# EAGLE design STMv1 (EAGLE 7.3.0)
CNAME: EARS PocketQube Template; CREVISION: 0.1; DESIGNER: M. Isbell & L. Stant
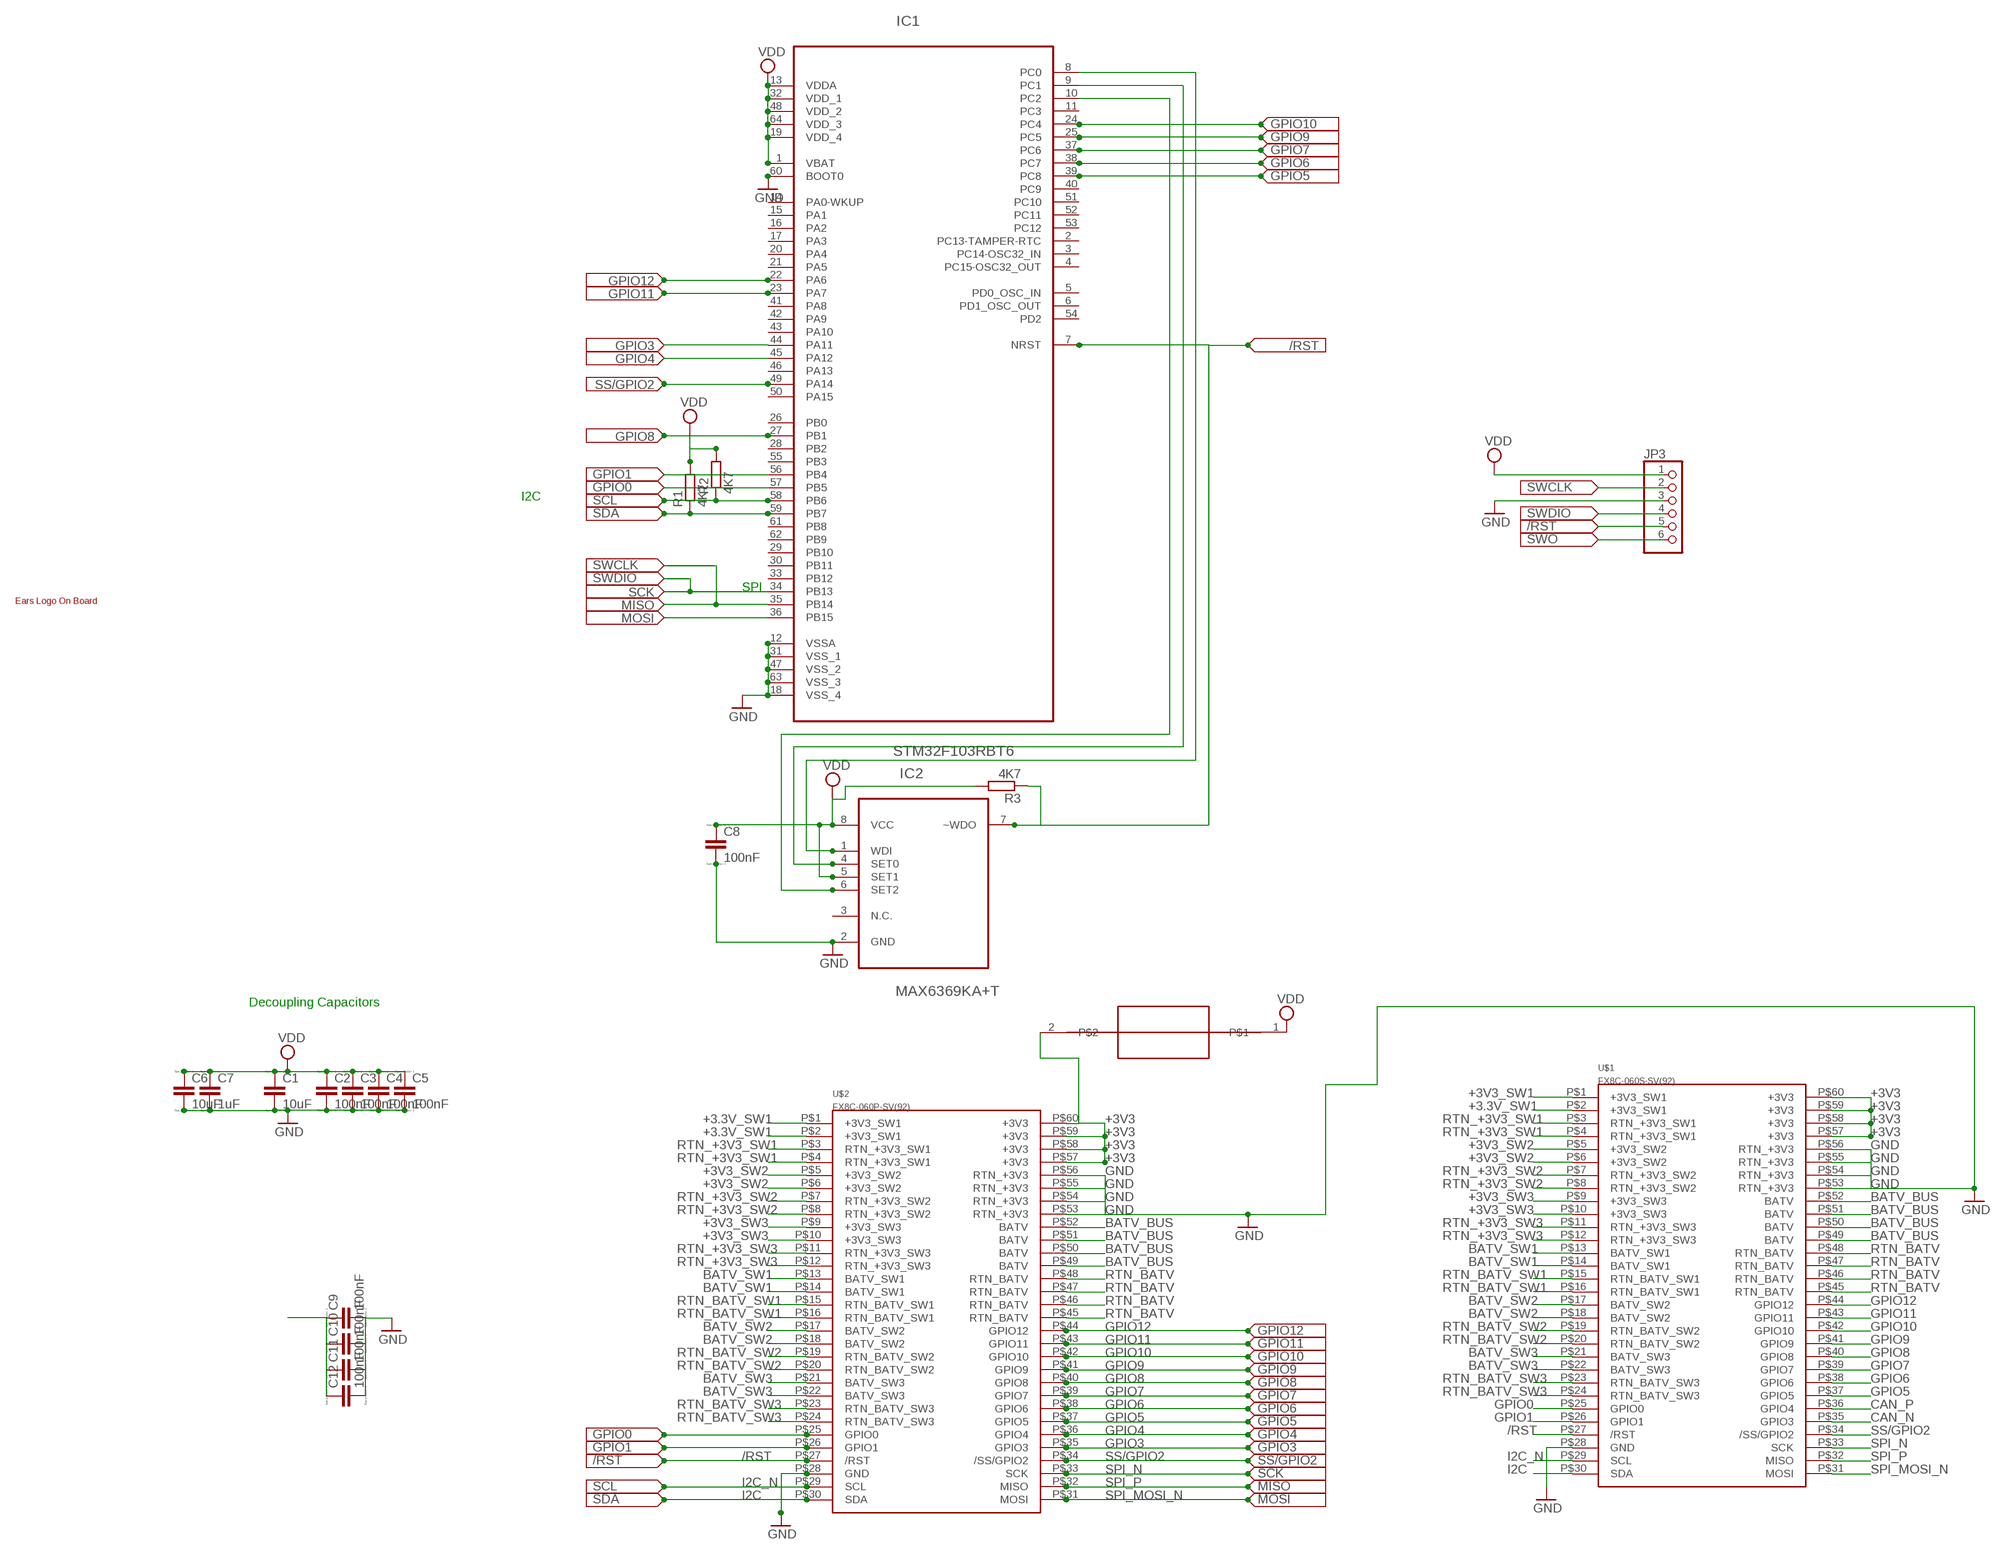
[diagram p0: schematic, sheet 1]

## Parts
C1  10uF  CC0603  [C0603]
C2  100nF  CC0603  [C0603]
C3  100nF  CC0603  [C0603]
C4  100nF  CC0603  [C0603]
C5  100nF  CC0603  [C0603]
C6  10uF  CC0603  [C0603]
C7  1uF  CC0603  [C0603]
C8  100nF  CC0603  [C0603]
C9  100nF  CC0603  [C0603]
C10  100nF  CC0603  [C0603]
C11  100nF  CC0603  [C0603]
C12  100nF  CC0603  [C0603]
FUSE  0603POLYFUSE  [R0603]
IC1  STM32F103RBT6  [QFP50P1200X1200X160-64N]
IC2  MAX6369KA+T  [SOT65P280X145-8N]
JP3  PINHD-1X6  [1X06]
R1  4K7  R-EU_R0603  [R0603]
R2  4K7  R-EU_R0603  [R0603]
R3  4K7  R-EU_R0603  [R0603]
U$1  FX8C-060S-SV(92)  [FX8C-060S-SV(92)]
U$2  FX8C-060P-SV(92)  [FX8C-060P-SV(92)]
U$3  EARSLOGOFULL  [EARSLOGOFULL]

## Nets
+3.3V_SW1: U$1.P$2(+3V3_SW1) U$2.P$1(+3V3_SW1) U$2.P$2(+3V3_SW1)
+3V3: FUSE.2 U$1.P$57(+3V3) U$1.P$58(+3V3) U$1.P$59(+3V3) U$1.P$60(+3V3) U$2.P$57(+3V3) U$2.P$58(+3V3) U$2.P$59(+3V3) U$2.P$60(+3V3)
+3V3_SW1: U$1.P$1(+3V3_SW1)
+3V3_SW2: U$1.P$5(+3V3_SW2) U$1.P$6(+3V3_SW2) U$2.P$5(+3V3_SW2) U$2.P$6(+3V3_SW2)
+3V3_SW3: U$1.P$9(+3V3_SW3) U$1.P$10(+3V3_SW3) U$2.P$9(+3V3_SW3) U$2.P$10(+3V3_SW3)
/RST: IC1.7(NRST) IC2.7(~WDO) R3.1 U$1.P$27(/RST) U$2.P$27(/RST)
BATV_BUS: U$1.P$49(BATV) U$1.P$50(BATV) U$1.P$51(BATV) U$1.P$52(BATV) U$2.P$49(BATV) U$2.P$50(BATV) U$2.P$51(BATV) U$2.P$52(BATV)
BATV_SW1: U$1.P$13(BATV_SW1) U$1.P$14(BATV_SW1) U$2.P$13(BATV_SW1) U$2.P$14(BATV_SW1)
BATV_SW2: U$1.P$17(BATV_SW2) U$1.P$18(BATV_SW2) U$2.P$17(BATV_SW2) U$2.P$18(BATV_SW2)
BATV_SW3: U$1.P$21(BATV_SW3) U$1.P$22(BATV_SW3) U$2.P$21(BATV_SW3) U$2.P$22(BATV_SW3)
CAN_N: U$1.P$35(GPIO3)
CAN_P: U$1.P$36(GPIO4)
CHASSIS_GND: C9.1 C10.1 C11.1 C12.1
GND: C1.2 C2.2 C3.2 C4.2 C5.2 C6.2 C7.2 C8.2 C9.2 C10.2 C11.2 C12.2 IC1.12(VSSA) IC1.18(VSS_4) IC1.31(VSS_1) IC1.47(VSS_2) IC1.60(BOOT0) IC1.63(VSS_3) IC2.2(GND) JP3.3(GND) U$1.P$28(GND) U$1.P$53(RTN_+3V3) U$1.P$54(RTN_+3V3) U$1.P$55(RTN_+3V3) U$1.P$56(RTN_+3V3) U$2.P$28(GND) U$2.P$53(RTN_+3V3) U$2.P$54(RTN_+3V3) U$2.P$55(RTN_+3V3) U$2.P$56(RTN_+3V3)
GPIO0: IC1.57(PB5) U$1.P$25(GPIO0) U$2.P$25(GPIO0)
GPIO1: IC1.56(PB4) U$1.P$26(GPIO1) U$2.P$26(GPIO1)
GPIO3: IC1.44(PA11) U$2.P$35(GPIO3)
GPIO4: IC1.45(PA12) U$2.P$36(GPIO4)
GPIO5: IC1.39(PC8) U$1.P$37(GPIO5) U$2.P$37(GPIO5)
GPIO6: IC1.38(PC7) U$1.P$38(GPIO6) U$2.P$38(GPIO6)
GPIO7: IC1.37(PC6) U$1.P$39(GPIO7) U$2.P$39(GPIO7)
GPIO8: IC1.27(PB1) U$1.P$40(GPIO8) U$2.P$40(GPIO8)
GPIO9: IC1.25(PC5) U$1.P$41(GPIO9) U$2.P$41(GPIO9)
GPIO10: IC1.24(PC4) U$1.P$42(GPIO10) U$2.P$42(GPIO10)
GPIO11: IC1.23(PA7) U$1.P$43(GPIO11) U$2.P$43(GPIO11)
GPIO12: IC1.22(PA6) U$1.P$44(GPIO12) U$2.P$44(GPIO12)
I2C: IC1.59(PB7) R1.1 U$1.P$30(SDA) U$2.P$30(SDA)
I2C_N: IC1.58(PB6) R2.1 U$1.P$29(SCL) U$2.P$29(SCL)
N$25: JP3.5(NRST)
N$26: JP3.6(SWO)
RTN_+3V3_SW1: U$1.P$3(RTN_+3V3_SW1) U$1.P$4(RTN_+3V3_SW1) U$2.P$3(RTN_+3V3_SW1) U$2.P$4(RTN_+3V3_SW1)
RTN_+3V3_SW2: U$1.P$7(RTN_+3V3_SW2) U$1.P$8(RTN_+3V3_SW2) U$2.P$7(RTN_+3V3_SW2) U$2.P$8(RTN_+3V3_SW2)
RTN_+3V3_SW3: U$1.P$11(RTN_+3V3_SW3) U$1.P$12(RTN_+3V3_SW3) U$2.P$11(RTN_+3V3_SW3) U$2.P$12(RTN_+3V3_SW3)
RTN_BATV: U$1.P$45(RTN_BATV) U$1.P$46(RTN_BATV) U$1.P$47(RTN_BATV) U$1.P$48(RTN_BATV) U$2.P$45(RTN_BATV) U$2.P$46(RTN_BATV) U$2.P$47(RTN_BATV) U$2.P$48(RTN_BATV)
RTN_BATV_SW1: U$1.P$15(RTN_BATV_SW1) U$1.P$16(RTN_BATV_SW1) U$2.P$15(RTN_BATV_SW1) U$2.P$16(RTN_BATV_SW1)
RTN_BATV_SW2: U$1.P$19(RTN_BATV_SW2) U$1.P$20(RTN_BATV_SW2) U$2.P$19(RTN_BATV_SW2) U$2.P$20(RTN_BATV_SW2)
RTN_BATV_SW3: U$1.P$23(RTN_BATV_SW3) U$1.P$24(RTN_BATV_SW3) U$2.P$23(RTN_BATV_SW3) U$2.P$24(RTN_BATV_SW3)
SET0: IC1.9(PC1) IC2.4(SET0)
SET2: IC1.10(PC2) IC2.6(SET2)
SPI_MOSI_N: IC1.36(PB15) U$1.P$31(MOSI) U$2.P$31(MOSI)
SPI_N: IC1.34(PB13) JP3.4(SWDIO) U$1.P$33(SCK) U$2.P$33(SCK)
SPI_P: IC1.35(PB14) JP3.2(SWCLK) U$1.P$32(MISO) U$2.P$32(MISO)
SS/GPIO2: IC1.49(PA14) U$1.P$34(/SS/GPIO2) U$2.P$34(/SS/GPIO2)
VDD: C1.1 C2.1 C3.1 C4.1 C5.1 C6.1 C7.1 C8.1 FUSE.1 IC1.1(VBAT) IC1.13(VDDA) IC1.19(VDD_4) IC1.32(VDD_1) IC1.48(VDD_2) IC1.64(VDD_3) IC2.5(SET1) IC2.8(VCC) JP3.1(VDD) R1.2 R2.2 R3.2
WDI: IC1.8(PC0) IC2.1(WDI)
Unconnected: IC1.2(PC13-TAMPER-RTC) IC1.3(PC14-OSC32_IN) IC1.4(PC15-OSC32_OUT) IC1.5(PD0_OSC_IN) IC1.6(PD1_OSC_OUT) IC1.11(PC3) IC1.14(PA0-WKUP) IC1.15(PA1) IC1.16(PA2) IC1.17(PA3) IC1.20(PA4) IC1.21(PA5) IC1.26(PB0) IC1.28(PB2) IC1.29(PB10) IC1.30(PB11) IC1.33(PB12) IC1.40(PC9) IC1.41(PA8) IC1.42(PA9) IC1.43(PA10) IC1.46(PA13) IC1.50(PA15) IC1.51(PC10) IC1.52(PC11) IC1.53(PC12) IC1.54(PD2) IC1.55(PB3) IC1.61(PB8) IC1.62(PB9) IC2.3(N.C.)

## Notes on the sheet
- I2C
- SPI
- Decoupling Capacitors

## Library data of the parts
C1-C12 = eagle-ltspice:C: CAPACITOR, European symbol; SPICEMODEL: NONE; SPICEPREFIX: C
FUSE = ears:0603POLYFUSE: 0.5A tripping polyfuse in a 0603 package http://uk.mouser.com/ProductDetail/Littelfuse/0603L050YR/?qs=sGAEpiMZZMsxR%252bBXi4wRUGXbnHLoKJyJNdWU1GmyYlY%3d
IC1 = st-Microelctronicl2:STM32F103RBT6: 32BIT MCU; MPN: STM32F103RBT6; OC_FARNELL: 1447640; OC_NEWARK: 59M2183; PACKAGE: LQFP-64; SUPPLIER: STMICROELECTRONICS
IC2 = maxim2:MAX6369KA+T: Pin-Selectable Watchdog Timers; MPN: MAX6369KA+T; OC_FARNELL: 1787051; OC_NEWARK: 68K9450; PACKAGE: SOT23-8; SUPPLIER: Maxim
JP3 = pinhead:PINHD-1X6: PIN HEADER
R1-R3 = rcl:R-EU_: RESISTOR, European symbol
U$1 = Template:FX8C-060S-SV(92)
U$2 = Template:FX8C-060P-SV(92)
U$3 = ears:EARSLOGO: The SurreyEARS logo for use on PCB silkscreens. Try to use the full logo where possible please.

## Board
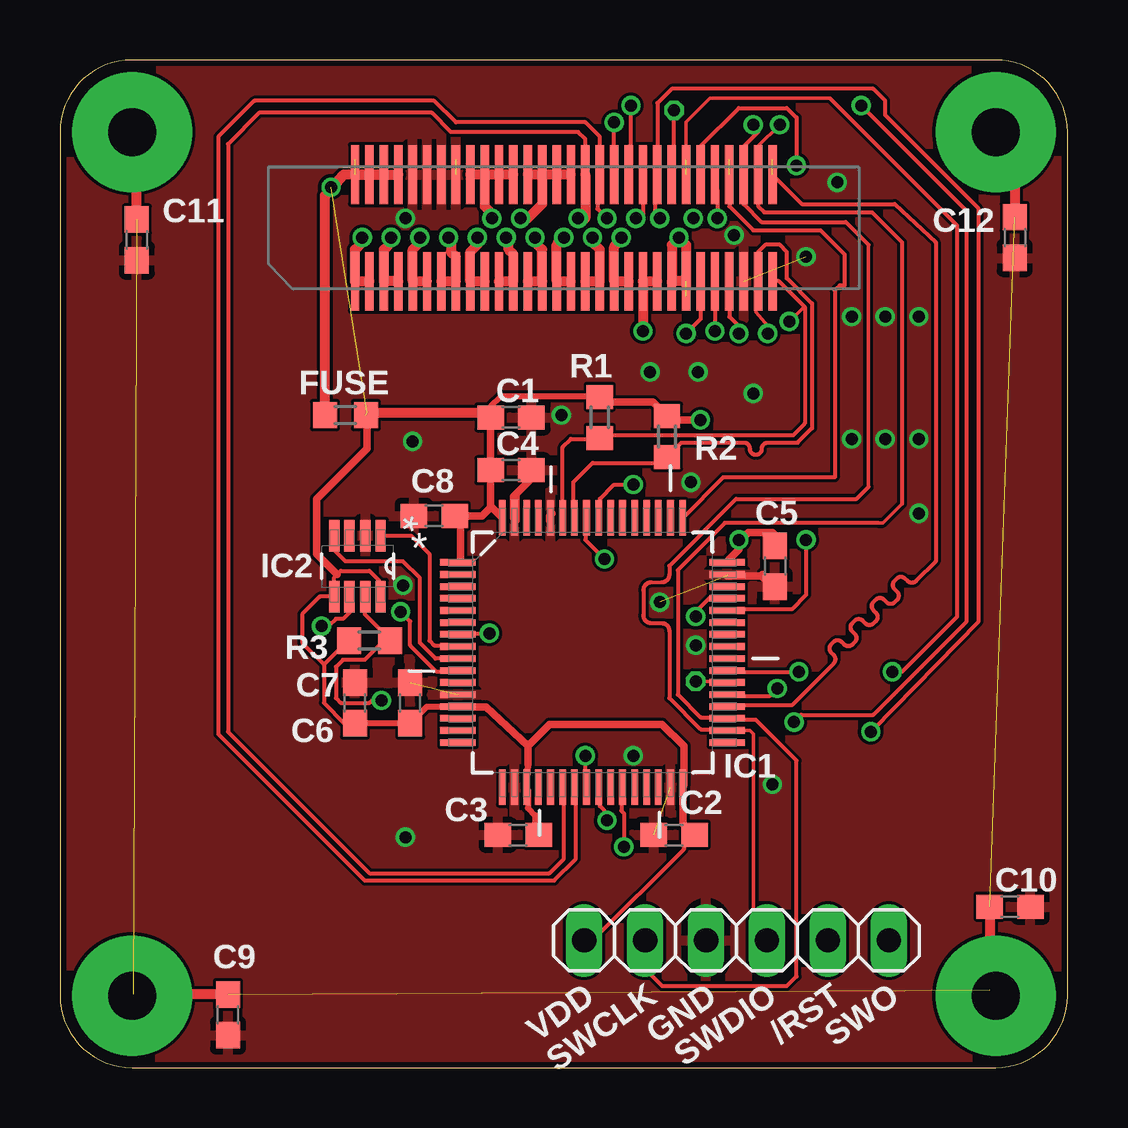
[diagram p1: board, top side]
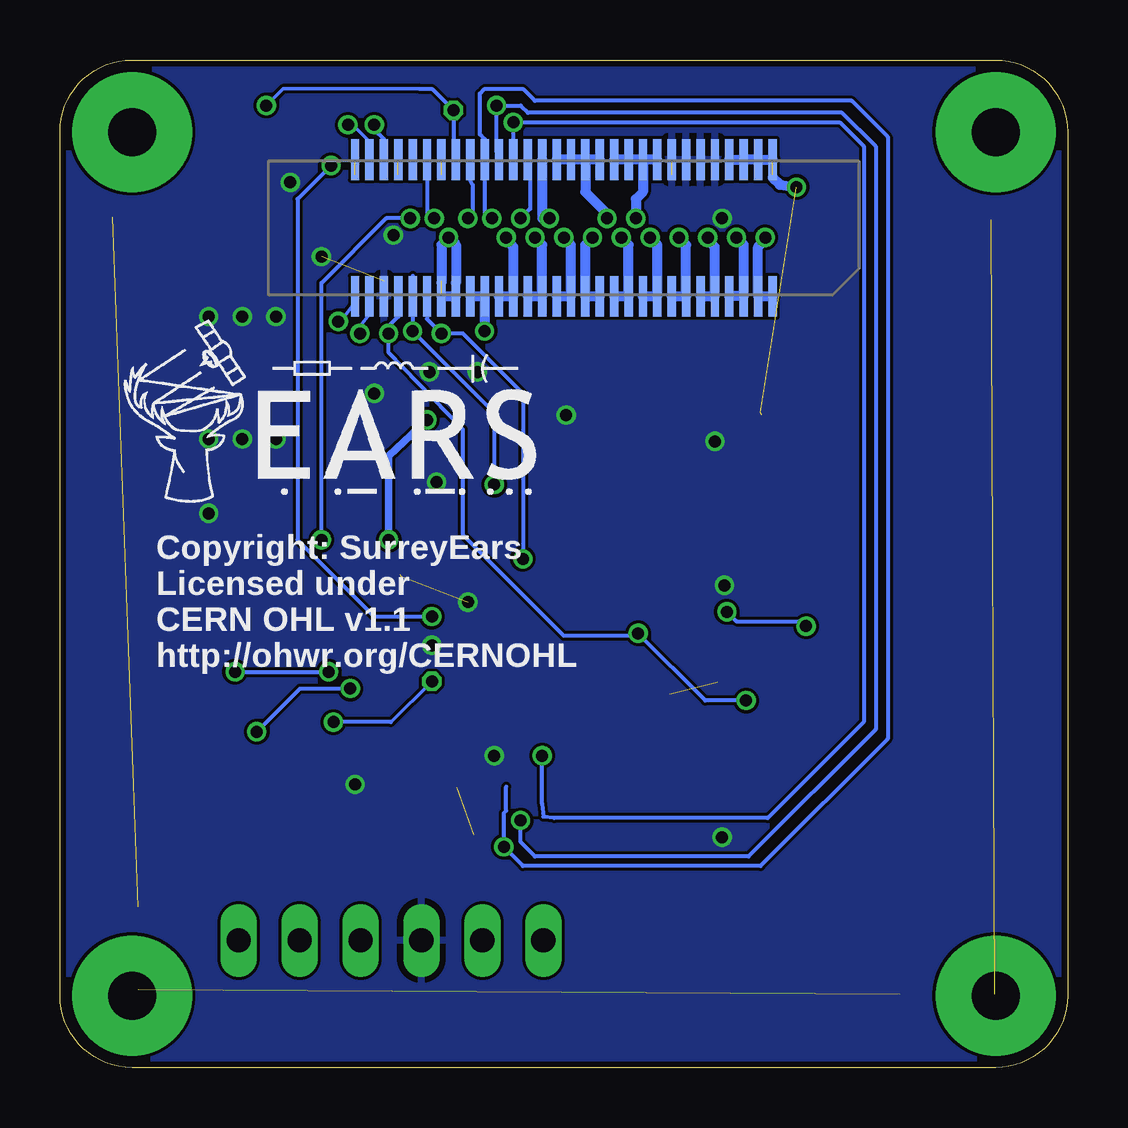
[diagram p2: board, bottom side, seen from below]

Size 42 x 42 mm. Coordinates in mm from the lower left corner, seen from the top.
Outline: 3,0 39,0 arc90 42,3 42,39 arc90 39,42 3,42 arc90 0,39 0,3 arc90 3,0
Copper layers (1*16): Top 0.035mm / dielectric 1.5mm / Bottom 0.035mm
Design rules "dirt_cheap_dirty_boards.v1": minimum track width 5mil, minimum drill 12mil, track to track 5mil, track to pad 5mil, pad to pad 5mil, via to via 5mil, smd to smd 0mil, copper to edge 10mil, drill to drill 10mil, minimum pad ring 10mil, minimum via ring 6mil, stop-mask expansion 2mil, vias tented up to drill 25mil, thermal gap 10mil

### Footprints (pad centres in the part's own frame; a part is rotated, then mirrored left to right if it is on the bottom)
C0603 = smd 1.1 x 1: 1 -0.85,0; 2 0.85,0
R0603 = smd 1 x 1.1: 1 -0.85,0; 2 0.85,0
QFP50P1200X1200X160-64N = smd 1.473 x 0.279: 1 -5.613,3.759; 2 -5.613,3.251; 3 -5.613,2.743; 4 -5.613,2.261; 5 -5.613,1.753; 6 -5.613,1.245; 7 -5.613,0.762; 8 -5.613,0.254; 9 -5.613,-0.254; 10 -5.613,-0.762; 11 -5.613,-1.245; 12 -5.613,-1.753; 13 -5.613,-2.261; 14 -5.613,-2.743; 15 -5.613,-3.251; 16 -5.613,-3.759; 33 5.613,-3.759; 34 5.613,-3.251; 35 5.613,-2.743; 36 5.613,-2.261; 37 5.613,-1.753; 38 5.613,-1.245; 39 5.613,-0.762; 40 5.613,-0.254; 41 5.613,0.254; 42 5.613,0.762; 43 5.613,1.245; 44 5.613,1.753; 45 5.613,2.261; 46 5.613,2.743; 47 5.613,3.251; 48 5.613,3.759 | smd 0.279 x 1.473: 17 -3.759,-5.613; 18 -3.251,-5.613; 19 -2.743,-5.613; 20 -2.261,-5.613; 21 -1.753,-5.613; 22 -1.245,-5.613; 23 -0.762,-5.613; 24 -0.254,-5.613; 25 0.254,-5.613; 26 0.762,-5.613; 27 1.245,-5.613; 28 1.753,-5.613; 29 2.261,-5.613; 30 2.743,-5.613; 31 3.251,-5.613; 32 3.759,-5.613; 49 3.759,5.613; 50 3.251,5.613; 51 2.743,5.613; 52 2.261,5.613; 53 1.753,5.613; 54 1.245,5.613; 55 0.762,5.613; 56 0.254,5.613; 57 -0.254,5.613; 58 -0.762,5.613; 59 -1.245,5.613; 60 -1.753,5.613; 61 -2.261,5.613; 62 -2.743,5.613; 63 -3.251,5.613; 64 -3.759,5.613
SOT65P280X145-8N = smd 1.321 x 0.432: 1 -1.27,0.965; 2 -1.27,0.33; 3 -1.27,-0.33; 4 -1.27,-0.965; 5 1.27,-0.965; 6 1.27,-0.33; 7 1.27,0.33; 8 1.27,0.965
1X06 = drill 1.016 long: 1 -6.35,0; 2 -3.81,0; 3 -1.27,0; 4 1.27,0; 5 3.81,0; 6 6.35,0
FX8C-060S-SV(92) = smd 0.35 x 1.7: P$1 -8.7,2.85; P$2 -8.1,2.85; P$3 -7.5,2.85; P$4 -6.9,2.85; P$5 -6.3,2.85; P$6 -5.7,2.85; P$7 -5.1,2.85; P$8 -4.5,2.85; P$9 -3.9,2.85; P$10 -3.3,2.85; P$11 -2.7,2.85; P$12 -2.1,2.85; P$13 -1.5,2.85; P$14 -0.9,2.85; P$15 -0.3,2.85; P$16 0.3,2.85; P$17 0.9,2.85; P$18 1.5,2.85; P$19 2.1,2.85; P$20 2.7,2.85; P$21 3.3,2.85; P$22 3.9,2.85; P$23 4.5,2.85; P$24 5.1,2.85; P$25 5.7,2.85; P$26 6.3,2.85; P$27 6.9,2.85; P$28 7.5,2.85; P$29 8.1,2.85; P$30 8.7,2.85; P$31 8.7,-2.85; P$32 8.1,-2.85; P$33 7.5,-2.85; P$34 6.9,-2.85; P$35 6.3,-2.85; P$36 5.7,-2.85; P$37 5.1,-2.85; P$38 4.5,-2.85; P$39 3.9,-2.85; P$40 3.3,-2.85; P$41 2.7,-2.85; P$42 2.1,-2.85; P$43 1.5,-2.85; P$44 0.9,-2.85; P$45 0.3,-2.85; P$46 -0.3,-2.85; P$47 -0.9,-2.85; P$48 -1.5,-2.85; P$49 -2.1,-2.85; P$50 -2.7,-2.85; P$51 -3.3,-2.85; P$52 -3.9,-2.85; P$53 -4.5,-2.85; P$54 -5.1,-2.85; P$55 -5.7,-2.85; P$56 -6.3,-2.85; P$57 -6.9,-2.85; P$58 -7.5,-2.85; P$59 -8.1,-2.85; P$60 -8.7,-2.85
FX8C-060P-SV(92) = smd 0.35 x 2.45: P$1 -8.7,-2.225; P$2 -8.1,-2.225; P$3 -7.5,-2.225; P$4 -6.9,-2.225; P$5 -6.3,-2.225; P$6 -5.7,-2.225; P$7 -5.1,-2.225; P$8 -4.5,-2.225; P$9 -3.9,-2.225; P$10 -3.3,-2.225; P$11 -2.7,-2.225; P$12 -2.1,-2.225; P$13 -1.5,-2.225; P$14 -0.9,-2.225; P$15 -0.3,-2.225; P$16 0.3,-2.225; P$17 0.9,-2.225; P$18 1.5,-2.225; P$19 2.1,-2.225; P$20 2.7,-2.225; P$21 3.3,-2.225; P$22 3.9,-2.225; P$23 4.5,-2.225; P$24 5.1,-2.225; P$25 5.7,-2.225; P$26 6.3,-2.225; P$27 6.9,-2.225; P$28 7.5,-2.225; P$29 8.1,-2.225; P$30 8.7,-2.225; P$31 8.7,2.225; P$32 8.1,2.225; P$33 7.5,2.225; P$34 6.9,2.225; P$35 6.3,2.225; P$36 5.7,2.225; P$37 5.1,2.225; P$38 4.5,2.225; P$39 3.9,2.225; P$40 3.3,2.225; P$41 2.7,2.225; P$42 2.1,2.225; P$43 1.5,2.225; P$44 0.9,2.225; P$45 0.3,2.225; P$46 -0.3,2.225; P$47 -0.9,2.225; P$48 -1.5,2.225; P$49 -2.1,2.225; P$50 -2.7,2.225; P$51 -3.3,2.225; P$52 -3.9,2.225; P$53 -4.5,2.225; P$54 -5.1,2.225; P$55 -5.7,2.225; P$56 -6.3,2.225; P$57 -6.9,2.225; P$58 -7.5,2.225; P$59 -8.1,2.225; P$60 -8.7,2.225

### Placement (x,y rotation side)
C1  18.8,27.1 0 top
C2  25.6,9.7 180 top
C3  19.1,9.7 180 top
C4  18.8,24.9 0 top
C5  29.8,20.9 270 top
C6  14.6,15.2 90 top
C7  12.3,15.2 90 top
C8  15.6,23 180 top
C9  7,2.2 270 top
C10  39.6,6.7 0 top
C11  3.2,34.5 270 top
C12  39.8,34.6 270 top
FUSE  11.9,27.2 180 top
IC1  22.2,17.3 0 top
IC2  12.4,20.9 270 top
JP3  28.2,5.3 0 top
R1  22.5,27.1 90 top
R2  25.3,26.3 90 top
R3  12.9,17.8 180 top
U$1  21,35 180 bottom
U$2  21,35 0 top
U$3  29.9,26.4 0 bottom

### Tracks (layer width: path | path; a pad name or v marks a point on that pad's centre or on a via)
+3.3V_SW1  (via drill 0.5)
  Top 0.406: U$2.P$2 U$2.P$1 12.3,34.1 12.6,34.4 v12.6,34.6
  Bottom 0.406: 12.3,32.2 12.3,32.15 U$1.P$2 12.9,34.2 12.6,34.5 v12.6,34.6
+3V3  (1 unrouted)
  Top 0.406: U$2.P$60 U$2.P$59 U$2.P$58 | U$2.P$58 U$2.P$57 | U$2.P$58 11.82,37.23 11.05,36.35 FUSE.2
  Bottom 0.406: U$1.P$57 U$1.P$58 U$1.P$59 U$1.P$60
+3V3_SW2  (via drill 0.5)
  Top 0.406: U$2.P$6 U$2.P$5 14.7,34.1 15,34.4 v15,34.6
  Bottom 0.406: U$1.P$6 U$1.P$5 14.7,34.2 14.9,34.4 14.9,34.5 v15,34.6
+3V3_SW3  (via drill 0.5)
  Top 0.406: U$2.P$10 U$2.P$9 17.1,34 17.4,34.3 v17.4,34.6
  Bottom 0.406: U$1.P$10 U$1.P$9 17.1,34.3 v17.4,34.6
/RST  (via drill 0.5)
  Top 0.17: IC2.7 12.7,19.6 12.7,18.9 13.5,18.1 13.7,18.1 R3.1 13.7,18 12.7,17 11.8,17 11.5,16.7 11.5,15.4 11.7,15.2 12.9,15.2 13,15.3 v13.4,15.3 | v17.9,18.1 16.6,18.1 IC1.7 | v28.3,30.6 28.3,30.9 27.9,31.3 U$2.P$27
  Bottom 0.17: v13.4,15.3 15.1,15.3 v17.9,18.1 17.9,18 21,18 25.2,22.2 25.2,26.6 28.3,29.8 v28.3,30.6 28.3,30.9 27.9,31.3 U$1.P$27
BATV_BUS  (via drill 0.5)
  Top 0.152: 17.83,37.23 17.83,37.19 U$2.P$51
  Top 0.406: U$2.P$49 U$2.P$50 17.83,37.23 U$2.P$51 | U$2.P$51 U$2.P$52 | U$2.P$51 17.7,35.9 18,35.6 v18,35.4 18,35.2
  Bottom 0.152: U$1.P$51 17.68,37.8 17.68,37.85
  Bottom 0.406: U$1.P$52 17.68,37.85 U$1.P$51 | U$1.P$51 U$1.P$50 U$1.P$49 | v18,35.4 18,36.2 17.7,36.5 U$1.P$51
BATV_SW1  (via drill 0.5)
  Top 0.406: U$2.P$13 U$2.P$14 20.1,34.1 19.7,34.5 v19.8,34.6
  Bottom 0.406: U$1.P$13 U$1.P$14 20.1,34.3 v19.8,34.6
BATV_SW2  (via drill 0.5)
  Top 0.406: U$2.P$17 U$2.P$18 22.5,34.1 22.3,34.3 22.3,34.6 v22.2,34.6
  Bottom 0.406: U$1.P$18 U$1.P$17 21.9,34.3 v22.2,34.6
BATV_SW3  (via drill 0.5)
  Top 0.406: U$2.P$22 U$2.P$21 v24.3,30.7
  Bottom 0.406: U$1.P$22 U$1.P$21 v24.3,30.7
CAN_P  (via drill 0.5)
  Top 0.17: v26.4,35.4 26.7,35.4
  Bottom 0.17: v26.4,35.4 26.7,35.4 U$1.P$36
CHASSIS_GND  (via drill 2 pad 5)  (3 unrouted)
  Top 0.152: 39.01,3.05 v39,3 38.86,3.05 | 3.05,38.86 v3,39 | 3.05,3.05 v3,3 | 39.01,38.86 v39,39
  Top 0.305: 3.05,38.86 3,38.86
  Top 0.406: 39.01,38.86 39.01,37.59 39.8,36.8 C12.1 | C10.1 38.75,3.25 v39,3 | C9.1 3.05,3.05 v3,3 | C11.1 3.2,38.8 v3,39
GND  (via drill 0.5)  (6 unrouted)
  Top 0.305: 27.8,20.5 29.3,20.5
  Top 0.406: 29.3,20.5 29.8,20
  other vias: 35.8,23.1 35.8,26.2 35.8,31.3 33,26.2 33,31.3 34.4,26.2 34.4,31.3 31.1,33.8 26.3,24.4 29.7,11.8 32.4,36.9 28.1,34.7 28.9,28.1 24.6,29 26.6,29 20.9,27.2 14.7,26.1 25,19.4 23.9,13 26.5,17.6 14.4,35.4 14.4,9.6 14.3,20.1
  pour Bottom (rank 2): 0.1,42.1 -0.1,0 42.2,0 41.9,42.4
  pour Top: 41.9,0.2 -0.1,-0.1 0,42.1 42.1,42.3
GPIO0  (via drill 0.5)
  Top 0.17: v26.1,30.6 26.7,31.2 U$2.P$25 | v22.7,21.2 21.9,22 21.9,22.9 IC1.57
  Bottom 0.152: 26.82,32.16 U$1.P$25
  Bottom 0.17: U$1.P$25 26.7,31.2 v26.1,30.6 25.2,30.6 22.7,28.1 v22.7,21.2 22.7,21.1
GPIO1  (via drill 0.5)
  Top 0.17: U$2.P$26 v27.3,30.7 | v23.9,24.3 23.1,24.3 22.5,23.7 22.5,23 IC1.56
  Bottom 0.17: 27.3,33 U$1.P$26 v27.3,30.7 23.9,27.3 v23.9,24.3 24,24.2
GPIO3  (via drill 0.5)
  Top 0.17: 27.9,19.1 IC1.44 27.86,19.1 30.5,19.1 31.1,19.7 v31.1,22 | v27.4,35.4 27.4,36.6 27.3,36.7 U$2.P$35
  Bottom 0.17: v27.4,35.4 28.4,35.4 31.1,32.7 v31.1,22
GPIO4  (via drill 0.5)
  Top 0.17: IC1.45 27.8,19.6 27.1,19.6 26.6,19.1 26.6,19 26.4,18.8 v26.5,18.8 | v30.7,37.6 30.7,39.6 30.3,40 28.3,40 26.7,38.4 U$2.P$36
  Bottom 0.17: v26.5,18.8 28.9,18.8 32.1,22 32.1,36.2 v30.7,37.6
GPIO5  (via drill 0.5)  (1 unrouted)
  Top 0.152: 32.1,40.4 27.1,40.4 26.1,39.4 U$2.P$37
  Top 0.17: 32.1,40.4 37.4,35.1 37.4,18.8 35.1,16.5 v34.7,16.5 | v30.8,16.5 27.9,16.5 IC1.39
  Bottom 0.17: v34.7,16.5 v30.8,16.5
GPIO6  (via drill 0.5)
  Top 0.152: v26.5,16.1 27.8,16.1 IC1.38
  Top 0.17: v30.6,14.4 30.9,14.7 33.9,14.7 37.8,18.6 37.8,35.7 v33.4,40.1 | U$2.P$38 25.5,38.3 25.6,38.4 v25.6,39.9
  Bottom 0.152: v26.5,16.1 28.2,14.4 | 27,40.8 32.7,40.8 v33.4,40.1
  Bottom 0.17: 28.2,14.4 v30.6,14.4 | 27,40.8 26.5,40.8 v25.6,39.9 25.6,37.95 U$1.P$38
GPIO7  (via drill 0.5)
  Top 0.17: v25,35.4 24.8,35.6 24.8,36.6 24.9,36.7 U$2.P$39 24.9,40.2 25.5,40.8 33.9,40.8 34.4,40.3 34.4,39.7 38.3,35.8 38.3,18.6 33.9,14.1 v33.8,14 | v29.9,15.8 29.6,15.5 27.9,15.5 IC1.37
  Bottom 0.17: v25,35.4 24.8,35.6 24.8,36.8 24.9,37 U$1.P$39 | v29.9,15.8 32,15.8 v33.8,14
GPIO8  (via drill 0.5, 0.5 pad 0.41)
  Top 0.17: v24,35.4 24.3,35.4 U$2.P$40 | v23.5,9.2 23.5,10.6 23.4,10.7 23.4,11.6 IC1.27
  Bottom 0.17: v24,35.4 24.3,35.4 U$1.P$40 24.3,38.7 24.5,38.9 24.5,40.6 24.3,40.8 22.7,40.8 22.2,40.3 9,40.3 7.5,38.8 7.5,13.7 12.8,8.4 22.7,8.4 v23.5,9.2 23.5,10.6 23.4,10.7 23.4,11.7
GPIO9  (via drill 0.5 pad 0.41)
  Top 0.17: U$2.P$41 23.7,38.4 23.8,38.4 v23.8,40.1 | v22.8,10.3 22.8,10.6 22.5,10.9 22.5,11.6 IC1.25
  Bottom 0.17: U$1.P$41 23.8,38.2 v23.8,40.1 22.8,40.1 22.5,39.8 9.4,39.8 8,38.4 8,14.1 13.3,8.8 22.2,8.8 22.8,9.4 v22.8,10.3
GPIO10  (via drill 0.5 pad 0.41)
  Top 0.17: U$2.P$42 v23.1,39.4 | v21.9,13 21.9,11.7 IC1.24
  Bottom 0.17: U$1.P$42 v23.1,39.4 9.5,39.4 8.5,38.4 8.5,14.4 12.5,10.4 21.4,10.4 21.85,10.45 21.9,11 v21.9,13
GPIO11  (via drill 0.5 pad 0.41)
  Top 0.17: IC1.23 21.5,11.62 21.5,8.7 20.6,7.8 12.7,7.8 6.6,13.9 6.6,38.8 8.1,40.3 15.6,40.3 16.5,39.4 21.9,39.4 22.5,38.8 U$2.P$43 22.5,36.7 22.4,36.7 22.4,35.8 v22.8,35.4
  Bottom 0.17: v22.8,35.4 22.4,35.8 22.4,37.3 22.5,37.3 U$1.P$43
GPIO12  (via drill 0.5 pad 0.41)
  Top 0.17: 21.9,35.4 21.9,38.7 21.6,39 16.3,39 15.5,39.8 8.3,39.8 7,38.5 7,14 12.9,8.1 20.4,8.1 21,8.7 21,11.64 IC1.22
  Top 0.406: U$2.P$44 21.9,35.4 v21.6,35.4
  Bottom 0.406: v21.6,35.4 21.9,35.4 U$1.P$44
I2C  (via drill 0.5)
  Top 0.152: 31.05,31.7 31.02,31.72 v30.4,31.1 | 22.45,26.2 R1.1 22.85,26.15 23,26.3
  Top 0.17: 31.02,31.72 29.97,32.77 U$2.P$30 | IC1.59 20.95,25.86 21.3,26.2 22.45,26.2 | 31.05,31.7 31.05,26.85 30.55,26.35 22.6,26.35
  Top 0.177: 22.6,26.35 R1.1
  Bottom 0.152: U$1.P$30 29.7,31.9 30.3,31.1 v30.4,31.1
I2C_N  (via drill 0.5)
  Top 0.152: IC1.58 21.4,22.91 | 25.3,25.5 R2.1 25.25,25.2 | 29.1,34 U$2.P$29 29,31.5 29.5,30.9 v29.5,30.6
  Top 0.17: 29.1,34 29.4,34.3 30,34.3 30.3,34 30.3,32.9 31.35,31.85 31.35,26.65 30.75,26.05 29.5,26.05 arc90 29.26,25.8 29.26,25.79 arc-90 29.01,25.55 29,25.55 arc-90 28.75,25.79 28.75,25.8 arc90 28.51,26.05 25.9,26.05 R2.1 | 21.4,22.91 21.4,24.4 22.2,25.2 25.25,25.2
  Bottom 0.152: v29.5,30.6 29.5,30.9 29.1,31.4 U$1.P$29
N$1
  Top 0.305: 20.4,22.8 20.4,23 20.5,23.1
N$22
  Top 0.305: 19.6,24.9 19.6,24.5 19,23.9 | 19,23.9 18.9,23.8 18.9,22.9 19,22.8 19,23.9
N$40  (via drill 0.5)
  Top 0.406: 25.5,32.7 25.5,34.3 v25.8,34.6 26.1,34.3 26.1,32.6
  Bottom 0.406: 25.5,32.7 25.5,34.3 v25.8,34.6 26.1,34.3 26.1,32.7
N$42
  Top 0.152: 26,23.4 26,22.6
N$66
  Top 0.406: 14.5,14.3 14.6,14.3
N$69
  Top 0.406: 17.8,27.1 17.9,27.1
N$70
  Top 0.406: 17.9,24.8 18.3,24.8
RTN_+3V3_SW1  (via drill 0.5)
  Top 0.406: U$2.P$4 U$2.P$3 13.5,34.1 13.8,34.4 v13.8,34.6 13.8,34.7
  Bottom 0.406: U$1.P$4 U$1.P$3 13.5,34.3 v13.8,34.6
RTN_+3V3_SW2  (via drill 0.5)
  Top 0.406: U$2.P$7 U$2.P$8 16.5,33.8 16.3,34 16.3,34.5 v16.2,34.6
  Bottom 0.406: U$1.P$8 U$1.P$7 15.9,34.3 v16.2,34.6
RTN_+3V3_SW3  (via drill 0.5)
  Top 0.406: U$2.P$11 U$2.P$12 18.9,33.9 18.7,34.1 18.7,34.5 v18.6,34.6
  Bottom 0.406: U$1.P$12 U$1.P$11 18.3,34.3 v18.6,34.6
RTN_BATV  (via drill 0.5)
  Top 0.152: U$2.P$47 20.12,37.34 20.12,37.23
  Top 0.305: U$2.P$46 U$2.P$47
  Top 0.406: U$2.P$45 U$2.P$46 20.12,37.23 U$2.P$47 | U$2.P$47 U$2.P$48 | U$2.P$47 20.1,36 19.5,35.4 v19.2,35.4
  Bottom 0.152: 20.12,37.85 20.12,37.8 U$1.P$47 20.12,37.95
  Bottom 0.406: U$1.P$48 U$1.P$47 | U$1.P$47 20.12,37.85 U$1.P$46 U$1.P$45 | v19.2,35.4 19.2,35.6 20.1,36.5 U$1.P$47
RTN_BATV_SW1  (via drill 0.5)
  Top 0.406: U$2.P$16 U$2.P$15 20.7,34.3 v21,34.6
  Bottom 0.406: U$1.P$16 U$1.P$15 20.7,34.3 v21,34.6
RTN_BATV_SW2  (via drill 0.5)
  Top 0.406: U$2.P$20 U$2.P$19 23.1,34.2 v23.4,34.6
  Bottom 0.406: U$1.P$20 U$1.P$19 23.1,34.2 v23.4,34.6
RTN_BATV_SW3  (1 unrouted)
  Top 0.406: U$2.P$24 U$2.P$23
  Bottom 0.406: U$1.P$24 U$1.P$23
SET0
  Top 0.17: IC1.9 15.65,17.05 15,17.7 15,20.4 14.3,21.1 11.9,21.1 11.4,21.6 11.4,22.14 IC2.4
SET2  (via drill 0.5)
  Top 0.17: v14.2,19 14.6,18.6 14.6,17.6 15.7,16.5 16.5,16.5 IC1.10 | v10.9,18.4 11.2,18.4 11.5,18.7 11.8,18.7 12.1,19 12.1,19.6 IC2.6
  Bottom 0.17: v14.2,19 13.8,18.6 11.1,18.6 v10.9,18.4
SPI_MOSI_N  (1 unrouted)
  Top 0.152: U$2.P$31 29.7,36.4 | 27.95,15.1 IC1.36
  Top 0.17: 27.95,15.1 30.5,15.1 32.25,16.85 arc90 32.25,17.2 32.15,17.3 arc-90 32.15,17.64 32.24,17.74 arc-90 32.59,17.74 32.69,17.64 arc90 33.03,17.64 33.13,17.73 arc90 33.13,18.08 33.03,18.18 arc-90 33.03,18.53 33.12,18.62 arc-90 33.47,18.62 33.57,18.52 arc90 33.92,18.52 34.01,18.61 arc90 34.01,18.96 33.91,19.06 arc-90 33.91,19.41 34,19.5 arc-90 34.35,19.5 34.45,19.4 arc90 34.8,19.4 34.89,19.49 arc90 34.89,19.84 34.79,19.94 arc-90 34.79,20.29 34.88,20.38 arc-90 35.23,20.38 35.33,20.28 arc90 35.68,20.28 36.5,21.1 36.5,34.4 34.8,36 30.93,36 U$2.P$31
SPI_N  (via drill 0.5)
  Top 0.152: U$2.P$33 28.5,35.98 | 27.76,14.1 IC1.34 28.75,14.05 28.9,13.9 28.9,5.27 JP3.4 | 33.7,24.2 33.7,34.3 | 25.07,20.22 24.64,20.22
  Top 0.17: 28.5,35.98 29.24,35.25 32.75,35.25 33.7,34.3 | 28.18,23.7 25.4,20.92 25.4,20.55 arc-90 25.07,20.22 | 27.76,14.1 26.7,14.1 25.4,15.4 25.4,18.2 arc90 25.07,18.53 24.64,18.53 arc-90 24.32,18.85 24.32,19.9 arc-90 24.64,20.22 | U$2.P$33 28.5,38.4 29.1,39 29.1,39.2 29,39.2 v28.9,39.3
  Top 0.174: 28.18,23.7 33.2,23.7 33.7,24.2
  Bottom 0.17: v28.9,39.3 28.9,39.1 28.5,38.7 U$1.P$33
SPI_P  (via drill 0.5)
  Top 0.152: 27.77,14.6 IC1.35 | v30,39.3 29.1,38.4 U$2.P$32 | 34.1,22.7 34.3,22.7 35.1,23.5
  Top 0.17: U$2.P$32 29.1,35.92 29.36,35.65 33.85,35.65 35.1,34.4 35.1,23.5 | 34.1,22.7 27.72,22.7 25.75,20.74 25.75,15.55 26.7,14.6 27.77,14.6 | JP3.2 24.39,4.11 25.1,3.4 30.3,3.4 30.7,3.8 30.7,12.8 29,14.5 27.87,14.5 IC1.35
  Bottom 0.152: 30.1,39.2 29.7,39.2 29.1,38.6 U$1.P$32 | 30.1,39.2 30.3,39.2 | v30,39.3 30.1,39.2
SS/GPIO2  (1 unrouted)
  Top 0.17: U$2.P$34 27.9,35.9 28.9,34.9 31.7,34.9 32.7,33.9 32.7,32.6 32.5,32.6 32.3,32.4 32.3,24.6 27.65,24.6 IC1.49
VDD  (via drill 0.5)  (2 unrouted)
  Top 0.152: 26.36,9.75 C2.1 | 26.06,11.58 IC1.32 | 19.81,9.75 C3.1 | 19.51,11.58 IC1.19 | 29.72,21.64 C5.1 | 27.89,21.18 IC1.48 | 25.3,26.98 R2.2 25.45,26.82 | 22.55,27.74 R1.2
  Top 0.17: 13.4,19.7 IC2.8 13.3,19.7 13.3,20.3 12.9,20.7 11.7,20.7 11.55,20.55 11.44,20.43 IC2.5 | 16.4,21.1 IC1.1 | R3.2 12,17.8 11,16.8 | 11.4,19.6 IC2.5 | 11,16.8 11,15.2 11.85,14.35 C7.1 | 17.9,23.3 17.95,23.4 | IC2.5 10.83,19.63 10.1,18.9 10.1,17.7 11,16.8 | C2.1 26.1,9.7 26,9.6 26,9.1 22.2,5.3 JP3.1
  Top 0.254: IC1.13 15.29,15.04 C6.1 C7.1 | 19.81,9.75 19.81,10.52 19.51,10.82 19.51,11.58 | C1.1 17.95,27.55 18.4,28 22.35,28 R1.2 | 26,11.7 IC1.32
  Top 0.275: 19.5,12.63 IC1.19
  Top 0.305: C1.1 C4.1 17.95,23.4 IC1.64 | 26.36,9.75 25.96,10.16 IC1.32 26,11.8 26,13.4 25.1,14.3 20.4,14.3 19.5,13.4 | C8.1 17.6,23 17.9,23.3 | C8.1 16.59,23 | IC1.1 16.7,21.1 16.7,22.9 C8.1 | 28.3,21.9 28.7,22.3 29.7,22.3 29.8,22.2 C5.1 | 28.3,21.9 28.3,21.6 27.9,21.2 27.89,21.18 | v28.3,22 28.3,21.9 | v26.7,27 25.4,27 R2.2 24.71,27.74 22.55,27.74 | IC1.13 17.76,15.04 19.5,13.4 | 19.5,13.4 19.5,12.63 | 11.55,20.55 10.7,21.4 10.7,23.7 12.8,25.8 12.8,27.3
  Top 0.406: 11.82,37.23 v11.3,36.7 | 12.8,27.3 17.75,27.3 C1.1
  Bottom 0.305: v28.3,22 28.3,25.5 v26.7,27
  Bottom 0.406: v11.3,36.7 12,36.8 12.3,37.1
WDI
  Top 0.17: IC2.1 14.63,22.17 15.4,21.4 15.4,17.8 15.6,17.6 16.54,17.6 IC1.8

### Text on the board
tPlace: VDD | SWCLK | GND | SWDIO | /RST | SWO
bPlace: Copyright: SurreyEars / Licensed under / CERN OHL v1.1 / http://ohwr.org/CERNOHL